# EAGLE board FE3_V3_R11_Release (EAGLE 7.6.0), part 1 of 2
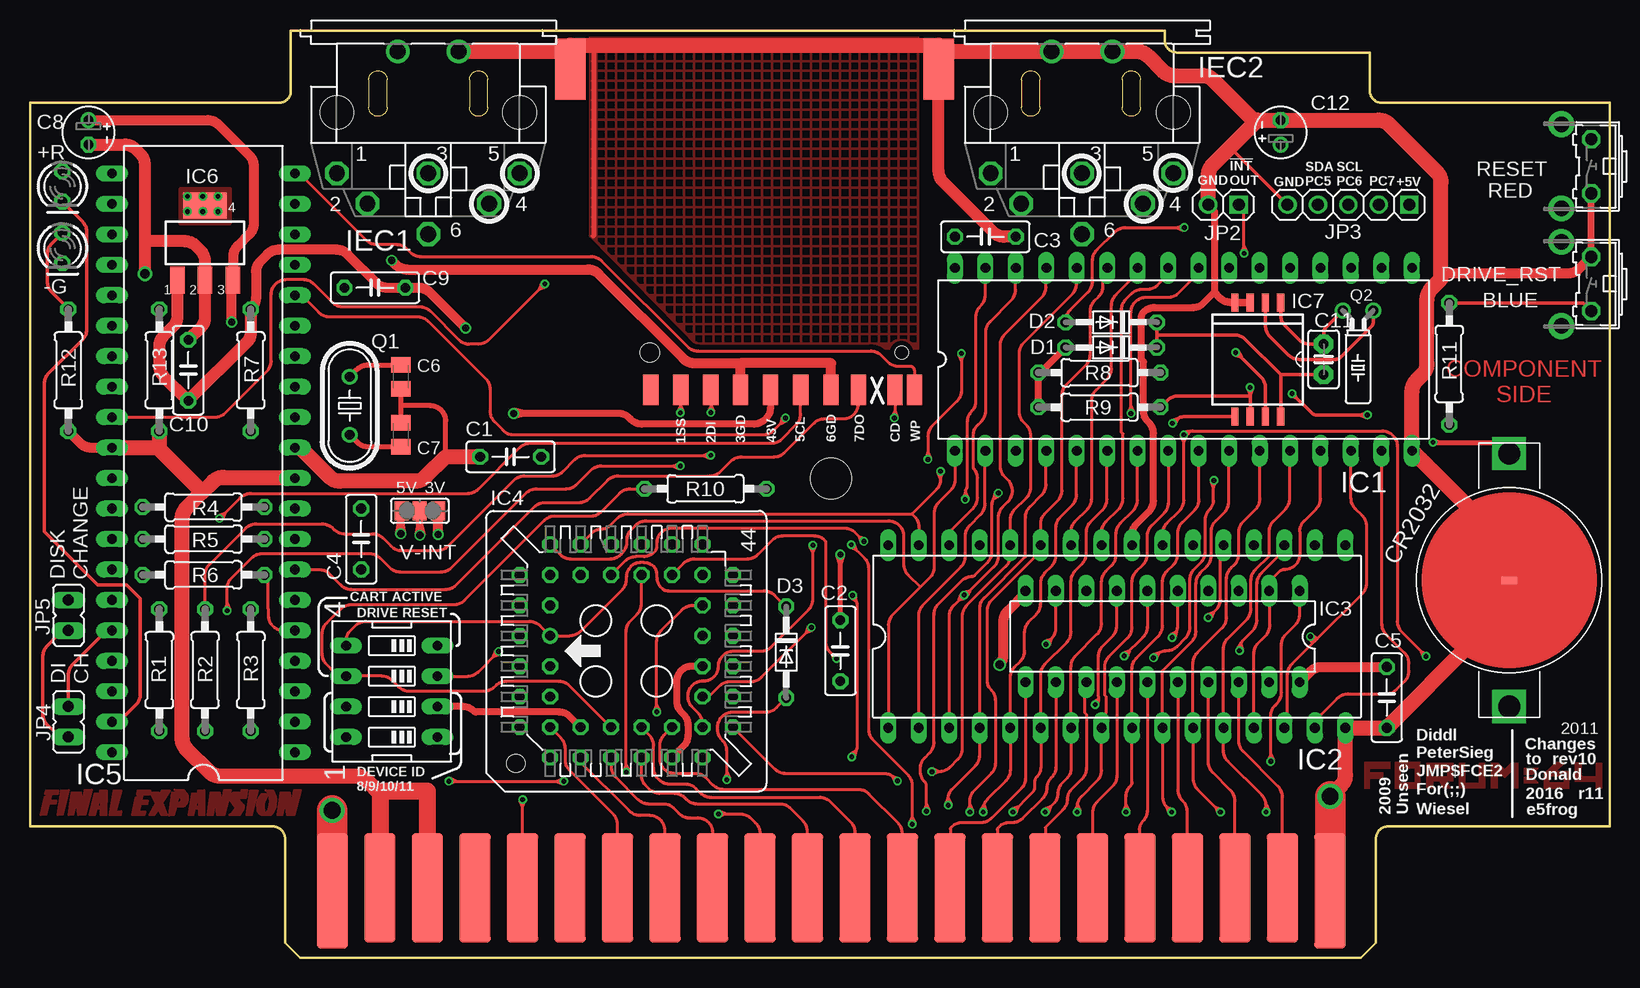
[diagram p1: board, top side]
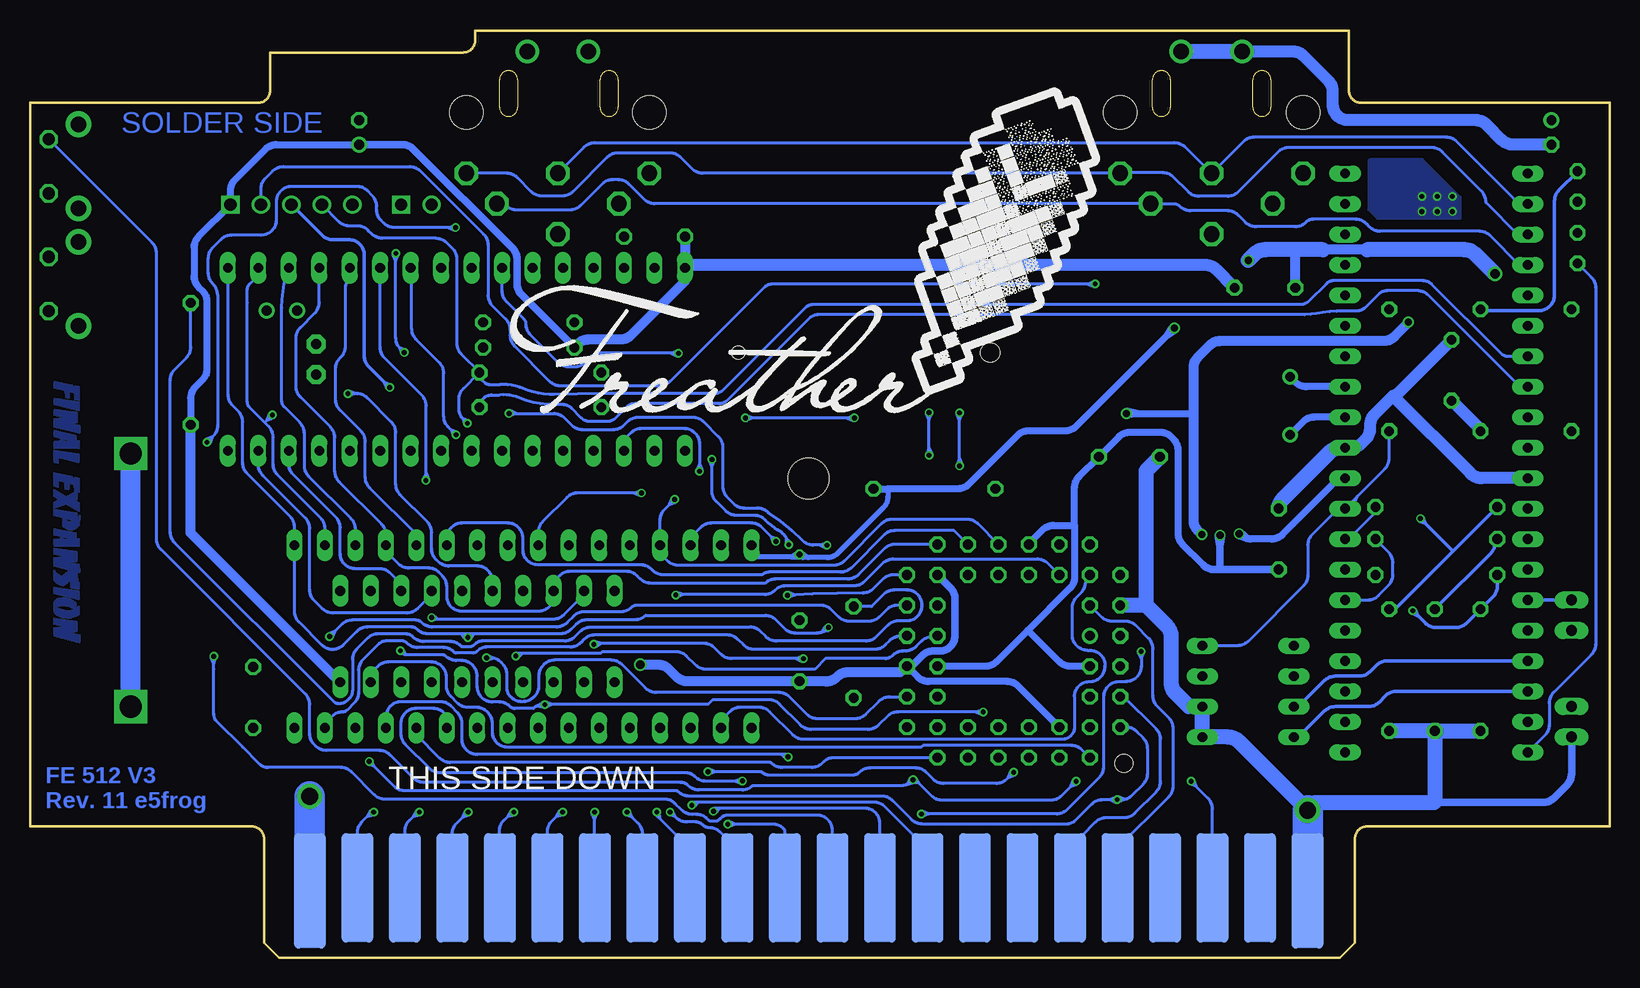
[diagram p2: board, bottom side, seen from below]

Size 131.7 x 77.3 mm. Coordinates in mm from the lower left corner, seen from the top.
Outline: 0,10.96 20.26,10.96 arc-90 21.26,9.96 21.26,1.27 22.53,0 110.92,0 112.19,1.27 112.19,9.96 arc-90 113.19,10.96 131.7,10.96 131.7,71.3 112.69,71.3 arc-90 111.69,72.3 111.69,75.49 95.59,75.49 arc-90 94.59,76.49 94.59,77.3 21.75,77.3 21.75,72.3 arc-90 20.75,71.3 0,71.3 0,10.96
Outline: 28.24,73.22 arc-180 29.77,73.22 29.77,70.93 arc-180 28.24,70.93 28.24,73.22
Outline: 36.62,73.22 arc-180 38.15,73.22 38.15,70.93 arc-180 36.62,70.93 36.62,73.22
Outline: 82.66,73.22 arc-180 84.19,73.22 84.19,70.93 arc-180 82.66,70.93 82.66,73.22
Outline: 91.04,73.22 arc-180 92.57,73.22 92.57,70.93 arc-180 91.04,70.93 91.04,73.22
Copper layers (1*16): Top 0.035mm / dielectric 1.5mm / Bottom 0.035mm
Design rules "ITEADstudio_DRC": minimum track width 6mil, minimum drill 12mil, track to track 6mil, track to pad 6mil, pad to pad 6mil, via to via 6mil, smd to smd 0mil, copper to edge 10mil, drill to drill 10mil, minimum pad ring 10mil, minimum via ring 6mil, stop-mask expansion 2mil, vias tented up to drill 100mil, thermal gap 10mil
Net classes: 1 DiffPair: width 0.254 mm, drill 0.4 mm, clearance 0.6 mm
Holes 3.4 mm at 66.79,39.97
Holes 1.5 mm at 40.5,16.22
Holes 1.6 mm at 51.65,50.47
Holes 1.1 mm at 72.65,50.47
tRestrict: area 117,15.2 to 118.1,15.8; area 126.7,14.7 to 127.8,15.1

## Footprints (pad centres in the part's own frame; a part is rotated, then mirrored left to right if it is on the bottom)
SMD1,27-2,54 = smd 1.27 x 2.54: 1 0,0
LED3MM = drill 0.813 octagon: A -1.27,0; K 1.27,0
C050-025X075 = drill 0.813 octagon: 1 -2.54,0; 2 2.54,0
C0805K = smd 1.3 x 1.6: 1 -1,0; 2 1,0
E2-4 = drill 0.813 pad 1.27: + -1.016,0 | drill 0.813 pad 1.27 octagon: - 1.016,0
C2.5-2 = drill 0.813 pad 1.6 octagon: 1 -1.27,0; 2 1.27,0
CR2032_RETAINER_PK5 = drill 1.85 square: P$1 -10.55,0; P$2 10.55,0 | smd 0.635 x 1.27: P$3 0,0
DO34-7 = drill 0.813 octagon: A 3.81,0; C -3.81,0
EDG-04 = drill 0.813 long: 1 -3.81,-3.81; 2 -1.27,-3.81; 3 1.27,-3.81; 4 3.81,-3.81; 5 3.81,3.81; 6 1.27,3.81; 7 -1.27,3.81; 8 -3.81,3.81
B3F-31XX = drill 1.016 octagon: 1 -2.261,-1.245; 2 2.261,-1.245 | drill 1.295 pad 2.159: 3 -3.505,1.245; 4 3.505,1.245
DIL32 = drill 0.813 long: 1 -17.78,-7.62; 2 -15.24,-7.62; 3 -12.7,-7.62; 4 -10.16,-7.62; 5 -7.62,-7.62; 6 -5.08,-7.62; 7 -2.54,-7.62; 8 0,-7.62; 9 2.54,-7.62; 10 5.08,-7.62; 11 7.62,-7.62; 12 10.16,-7.62; 13 12.7,-7.62; 14 15.24,-7.62; 15 17.78,-7.62; 16 20.32,-7.62; 17 20.32,7.62; 18 17.78,7.62; 19 15.24,7.62; 20 12.7,7.62; 21 10.16,7.62; 22 7.62,7.62; 23 5.08,7.62; 24 2.54,7.62; 25 0,7.62; 26 -2.54,7.62; 27 -5.08,7.62; 28 -7.62,7.62; 29 -10.16,7.62; 30 -12.7,7.62; 31 -15.24,7.62; 32 -17.78,7.62
DIL32' = drill 0.813 long: 1 -19.05,-7.62; 2 -16.51,-7.62; 3 -13.97,-7.62; 4 -11.43,-7.62; 5 -8.89,-7.62; 6 -6.35,-7.62; 7 -3.81,-7.62; 8 -1.27,-7.62; 9 1.27,-7.62; 10 3.81,-7.62; 11 6.35,-7.62; 12 8.89,-7.62; 13 11.43,-7.62; 14 13.97,-7.62; 15 16.51,-7.62; 16 19.05,-7.62; 17 19.05,7.62; 18 16.51,7.62; 19 13.97,7.62; 20 11.43,7.62; 21 8.89,7.62; 22 6.35,7.62; 23 3.81,7.62; 24 1.27,7.62; 25 -1.27,7.62; 26 -3.81,7.62; 27 -6.35,7.62; 28 -8.89,7.62; 29 -11.43,7.62; 30 -13.97,7.62; 31 -16.51,7.62; 32 -19.05,7.62
DIL20 = drill 0.813 long: 1 -11.43,-3.81; 2 -8.89,-3.81; 3 -6.35,-3.81; 4 -3.81,-3.81; 5 -1.27,-3.81; 6 1.27,-3.81; 7 3.81,-3.81; 8 6.35,-3.81; 9 8.89,-3.81; 10 11.43,-3.81; 11 11.43,3.81; 12 8.89,3.81; 13 6.35,3.81; 14 3.81,3.81; 15 1.27,3.81; 16 -1.27,3.81; 17 -3.81,3.81; 18 -6.35,3.81; 19 -8.89,3.81; 20 -11.43,3.81
S44 = drill 0.813: 1 1.27,6.35 | drill 0.813 octagon: 2 -1.27,8.89; 3 -1.27,6.35; 4 -3.81,8.89; 5 -3.81,6.35; 6 -6.35,8.89; 7 -8.89,6.35; 8 -6.35,6.35; 9 -8.89,3.81; 10 -6.35,3.81; 11 -8.89,1.27; 12 -6.35,1.27; 13 -8.89,-1.27; 14 -6.35,-1.27; 15 -8.89,-3.81; 16 -6.35,-3.81; 17 -8.89,-6.35; 18 -6.35,-8.89; 19 -6.35,-6.35; 20 -3.81,-8.89; 21 -3.81,-6.35; 22 -1.27,-8.89; 23 -1.27,-6.35; 24 1.27,-8.89; 25 1.27,-6.35; 26 3.81,-8.89; 27 3.81,-6.35; 28 6.35,-8.89; 29 8.89,-6.35; 30 6.35,-6.35; 31 8.89,-3.81; 32 6.35,-3.81; 33 8.89,-1.27; 34 6.35,-1.27; 35 8.89,1.27; 36 6.35,1.27; 37 8.89,3.81; 38 6.35,3.81; 39 8.89,6.35; 40 6.35,8.89; 41 6.35,6.35; 42 3.81,8.89; 43 3.81,6.35; 44 1.27,8.89
DIL40 = drill 0.813 long: 1 -24.13,-7.62; 2 -21.59,-7.62; 3 -19.05,-7.62; 4 -16.51,-7.62; 5 -13.97,-7.62; 6 -11.43,-7.62; 7 -8.89,-7.62; 8 -6.35,-7.62; 9 -3.81,-7.62; 10 -1.27,-7.62; 11 1.27,-7.62; 12 3.81,-7.62; 13 6.35,-7.62; 14 8.89,-7.62; 15 11.43,-7.62; 16 13.97,-7.62; 17 16.51,-7.62; 18 19.05,-7.62; 19 21.59,-7.62; 20 24.13,-7.62; 21 24.13,7.62; 22 21.59,7.62; 23 19.05,7.62; 24 16.51,7.62; 25 13.97,7.62; 26 11.43,7.62; 27 8.89,7.62; 28 6.35,7.62; 29 3.81,7.62; 30 1.27,7.62; 31 -1.27,7.62; 32 -3.81,7.62; 33 -6.35,7.62; 34 -8.89,7.62; 35 -11.43,7.62; 36 -13.97,7.62; 37 -16.51,7.62; 38 -19.05,7.62; 39 -21.59,7.62; 40 -24.13,7.62
SOT223 = smd 1.219 x 2.235: 1 -2.311,-3.099; 2 0,-3.099; 3 2.311,-3.099 | smd 3.6 x 2.2: 4 0,3.099
SOT176-1 = smd 0.6 x 1.5: 1 -1.905,-4.75; 2 -0.635,-4.75; 3 0.635,-4.75; 4 1.905,-4.75; 5 1.905,4.75; 6 0.635,4.75; 7 -0.635,4.75; 8 -1.905,4.75
MAB6H = drill 1.321 octagon: 1 7.62,5.08; 2 5.08,7.62; 3 0,5.08; 4 -5.08,7.62; 5 -7.62,5.08; 6 0,10.16 | drill 1.321: PE -2.54,-5.08; PE@ 2.54,-5.08 | hole 2.794: 7.62,0; -7.62,0
1X02 = drill 1.016 square: 1 -1.27,0 | drill 1.016: 2 1.27,0
1X05 = drill 1.016 square: 1 -5.08,0 | drill 1.016: 2 -2.54,0; 3 0,0; 4 2.54,0; 5 5.08,0
JP1 = drill 0.914 long: 1 0,-1.27; 2 0,1.27
SMD2,54-5,08 = smd 2.54 x 5.08: 1 0,0
HC49U-V = drill 0.813: 1 -2.413,0; 2 2.413,0
TC26H = drill 0.813: 1 -1.27,0; 2 1.27,0
0207/10 = drill 0.813 octagon: 1 -5.08,0; 2 5.08,0
VIC-20_EXPANSION = smd 2.6 x 9.6: P$1 -41.58,1.98; P$22 41.58,1.98 | smd 2.6 x 9.1: P$2 -37.62,2.23; P$3 -33.66,2.23; P$4 -29.7,2.23; P$5 -25.74,2.23; P$6 -21.78,2.23; P$7 -17.82,2.23; P$8 -13.86,2.23; P$9 -9.9,2.23; P$10 -5.94,2.23; P$11 -1.98,2.23; P$12 1.98,2.23; P$13 5.94,2.23; P$14 9.9,2.23; P$15 13.86,2.23; P$16 17.82,2.23; P$17 21.78,2.23; P$18 25.74,2.23; P$19 29.7,2.23; P$20 33.66,2.23; P$21 37.62,2.23 | smd 2.6 x 9.6 bottom: P$23 -41.58,1.98; P$44 41.58,1.98 | smd 2.6 x 9.1 bottom: P$24 -37.62,2.23; P$25 -33.66,2.23; P$26 -29.7,2.23; P$27 -25.74,2.23; P$28 -21.78,2.23; P$29 -17.82,2.23; P$30 -13.86,2.23; P$31 -9.9,2.23; P$32 -5.94,2.23; P$33 -1.98,2.23; P$34 1.98,2.23; P$35 5.94,2.23; P$36 9.9,2.23; P$37 13.86,2.23; P$38 17.82,2.23; P$39 21.78,2.23; P$40 25.74,2.23; P$41 29.7,2.23; P$42 33.66,2.23; P$43 37.62,2.23
SJ_2 = smd 1.168 x 1.6: 1 -1.524,0; 2 0,0; 3 1.524,0

## Placement (x,y rotation side)
1SS  [SMD1,27-2,54]  54.24,47.38 0 top
2DI  [SMD1,27-2,54]  56.75,47.38 0 top
3GD  [SMD1,27-2,54]  59.22,47.38 0 top
5CL  [SMD1,27-2,54]  64.25,47.38 0 top
6GD  [SMD1,27-2,54]  66.77,47.38 0 top
7DO  [SMD1,27-2,54]  69.06,47.38 0 top
43V  [SMD1,27-2,54]  61.73,47.38 0 top
+R  [LED3MM]  2.7,64.33 270 top
-G  [LED3MM]  2.7,59.18 270 top
C1  100nF  [C050-025X075]  40.05,41.78 180 top
C2  100nF  [C050-025X075]  67.55,25.61 270 top
C3  100nF  [C050-025X075]  79.64,60.13 0 top
C4  100nF  [C050-025X075]  27.61,34.92 90 top
C5  100nF  [C050-025X075]  113.1,21.72 270 top
C6  33pF  [C0805K]  30.91,48.45 270 top
C7  33pF  [C0805K]  30.91,43.62 90 top
C8  22µF  [E2-4]  4.88,68.83 270 top
C9  100nF  [C050-025X075]  28.75,55.88 180 top
C10  100nF  [C050-025X075]  13.2,49 90 top
C11  22pF  [C2.5-2]  107.84,49.91 90 top
C12  100µF  [E2-4]  104.25,68.83 90 top
CD  [SMD1,27-2,54]  72.11,47.38 0 top
CR2032  CR2032_RETAINER_PK5  [CR2032_RETAINER_PK5]  123.3,31.5 270 top
D1  BAT85  [DO34-7]  90.13,50.9 180 top
D2  BAT85  [DO34-7]  90.13,53 180 top
D3  BAT85  [DO34-7]  63.04,25.5 270 top
DEVICE  [EDG-04]  30.16,22.22 90 top
DRIVE_RST  [B3F-31XX]  128.9,56.2 90 top
IC1  AM29F040B  [DIL32]  94.88,49.91 0 top
IC2  4Mb-55  [DIL32']  90.6,26.8 0 top
IC3  74LS245N  [DIL20]  94.41,26.8 180 top
IC4  CPLD-ATF1504-AS  [S44]  49.71,25.59 90 top
IC5  ATMEGA1284P  [DIL40]  14.46,41.27 90 top
IC6  3V3REG_1703  [SOT223]  14.59,59.63 0 top
IC7  PCF8583T  [SOT176-1]  102.35,49.91 180 top
IEC1  MAB6H  [MAB6H]  33.2,70.5 180 top
IEC2  MAB6H  [MAB6H]  87.7,70.5 180 top
JP2  [1X02]  99.49,62.8 180 top
JP3  [1X05]  109.9,62.8 180 top
JP4  [JP1]  3.2,19.68 0 top
JP5  [JP1]  3.2,28.57 0 top
NC_9  [SMD1,27-2,54]  51.75,47.38 0 top
PAD1  [SMD2,54-5,08]  45.04,74.1 0 top
PAD2  [SMD2,54-5,08]  75.75,74.1 180 top
Q1  8.000MHz  [HC49U-V]  26.66,46.04 270 top
Q2  32768Hz  [TC26H]  110.7,53.98 180 top
R1  3k3  [0207/10]  10.78,24 90 top
R2  3k3  [0207/10]  14.59,24 90 top
R3  3k3  [0207/10]  18.4,24 90 top
R4  1k8  [0207/10]  14.46,37.59 0 top
R5  1k8  [0207/10]  14.46,34.92 0 top
R6  1k8  [0207/10]  14.46,31.94 0 top
R7  10k  [0207/10]  18.4,49 90 top
R8  1k8  [0207/10]  89.15,48.8 180 top
R9  1k8  [0207/10]  89.15,45.92 180 top
R10  10k  [0207/10]  56.31,39.12 180 top
R11  10k  [0207/10]  118.31,49.53 270 top
R12  470  [0207/10]  3.2,49 90 top
R13  470  [0207/10]  10.78,49 90 top
RESET  [B3F-31XX]  128.9,66 90 top
U$2  VIC-20_EXPANSION  [VIC-20_EXPANSION]  66.79,3.62 0 top
V-INT  [SJ_2]  32.5,37.27 180 top
WP  [SMD1,27-2,54]  73.73,47.36 0 top

## Tracks (layer width: path | path; a pad name or v marks a point on that pad's centre or on a via)
3V3  (via drill 0.6)
  Top 0.6: 43V.1 61.73,45.88 arc-45 61.35,44.99 61.25,44.88 arc-45 60.36,44.51 50.99,44.51 arc-45 50.1,44.88 49.95,45.03 arc45 49.05,45.4 v40.31,45.4 | v40.31,45.4 40.34,45.58 41.21,45.4 40.34,45.23 v40.31,45.4
  Top 0.813: v34.02,35.31 V-INT.1 | C8.+ 14.83,69.85 arc-45 15.72,69.48 18.28,66.92 arc-45 18.65,66.02 18.65,61.23 arc-45 18.28,60.33 17.31,59.36 arc45 16.94,58.47 16.94,56.57 IC6.3 16.81,56.44 v16.81,53.02
  Bottom 0.6: v40.31,45.4 34.78,45.4 34.72,45.47 | v40.31,45.4 40.27,45.23 39.41,45.4 40.27,45.58 v40.31,45.4
  Bottom 0.813: v16.81,53.02 16.81,52.96 17.96,51.81 arc45 18.86,51.44 32.48,51.44 arc-45 33.38,51.06 34.35,50.09 arc-45 34.72,49.19 34.72,45.47 34.72,36.53 arc-45 34.35,35.63 v34.02,35.31
!C_RESET  (via drill 0.4)
  Top 0.254: v34.91,14.73 v44.5,14.73 | v58.09,14.86 58.09,17.25 arc45 57.72,18.15 57.7,18.17 arc-45 57.33,19.07 57.33,19.24 arc-90 58.6,20.51 61.34,20.51 arc45 62.24,20.88 D3.A | v58.09,14.86 57.87,14.96 58.09,15.46 58.31,14.96 v58.09,14.86 | v34.91,14.73 35.01,14.95 35.51,14.73 35.01,14.51 v34.91,14.73 | v44.5,14.73 44.4,14.51 43.9,14.73 44.4,14.95 v44.5,14.73
  Bottom 0.254: 33.2,5.65 33.13,5.59 U$2.P$25 33.13,12.42 arc-45 33.5,13.32 v34.91,14.73 | v44.5,14.73 45.72,13.52 arc45 46.61,13.14 55.66,13.14 arc45 56.55,13.52 57.9,14.86 v58.09,14.86 | v58.09,14.86 58.22,14.72 arc45 59.12,14.35 71.49,14.35 arc45 72.33,14 75.95,14 arc45 76.84,14.37 arc-45 77.48,14.64 98.87,14.64 arc45 99.77,15.01 101.69,16.93 arc-45 102.59,17.3 107,17.3 arc45 107.89,17.68 108.01,17.79 arc45 108.38,18.69 108.38,21.13 arc-45 108.75,22.02 120.77,34.05 arc45 121.14,34.94 121.14,58.73 arc-45 121.52,59.63 RESET.2 | v58.09,14.86 58.12,14.62 57.58,14.54 57.89,14.99 v58.09,14.86 | v58.09,14.86 58.3,14.97 58.56,14.48 58.03,14.62 v58.09,14.86 | v34.91,14.73 35,14.51 34.49,14.31 34.68,14.82 v34.91,14.73 | v44.5,14.73 44.73,14.82 44.92,14.31 44.41,14.51 v44.5,14.73
!RESET
  Top 0.254: DEVICE.5 26.35,26.41 arc-45 26.72,27.3 27.11,27.7 arc-45 28.01,28.07 41.62,28.07 arc-45 42.52,27.7 42.98,27.23 arc45 43.88,26.86 | D3.C 63.01,29.3 62.08,30.23 arc45 61.18,30.61 53.25,30.61 arc-45 52.62,30.87 arc-45 52.25,31.77 52.25,32.1 arc45 52.05,32.59 arc45 51.15,32.96 50.87,32.96 arc45 50.08,32.63 arc45 49.71,31.73 49.71,31.58 arc-45 49.33,30.68 45.89,27.23 arc-45 44.99,26.86 43.88,26.86 | IC4.1 43.88,26.86
  Top 0.305: R11.1 129.47,54.61 DRIVE_RST.1
  Bottom 0.254: D3.C 61.55,29.3 60.55,30.3 arc45 59.66,30.67 58.6,30.67 arc90 57.33,29.4 arc90 58.6,28.13 59.28,28.13 arc-45 60.17,27.76 61.15,26.79 arc45 62.04,26.42 69.47,26.42 arc45 70.37,26.79 70.8,27.22 arc-45 71.7,27.59 84.96,27.59 arc-45 85.86,27.22 86.26,26.82 arc45 87.16,26.45 93.82,26.45 arc-45 94.72,26.08 arc45 95.05,25.94 95.61,25.94 arc45 95.78,26.01 arc-45 96.68,26.38 98.87,26.38 arc45 99.77,26.76 arc-45 100.4,27.02 102.68,27.02 arc-45 103.58,26.65 104.45,25.77 arc-45 104.82,24.87 104.82,22.29 arc45 105.12,21.58 arc45 106.02,21.21 arc45 106.37,21.35 119.63,34.62 arc45 120,35.52 120,48.18 arc45 119.63,49.08 118.66,50.05 arc-45 118.29,50.95 118.29,54.59 R11.1
!WE  (via drill 0.4)
  Top 0.254: IC1.31 79.64,55.29 arc-45 79.27,54.39 79.19,54.31 arc45 78.82,53.42 78.82,46.37 arc-45 78.49,45.58 arc45 78.12,44.69 78.12,39.37 arc-45 77.96,38.99 v77.96,38.23 | v77.96,38.23 77.74,38.33 77.96,38.83 78.19,38.33 v77.96,38.23
  Bottom 0.254: v77.96,38.23 78.8,37.39 arc-45 79.17,36.49 IC2.29 79.17,33.72 78.56,33.11 arc-45 77.66,32.73 64.71,32.73 arc-45 63.81,33.11 60.71,36.2 arc45 59.82,36.58 53.6,36.58 arc45 52.7,36.2 IC4.33 | v77.96,38.23 78.19,38.31 78.39,37.8 77.88,38 v77.96,38.23
+5V  (via drill 0.5, 0.6)
  Top 0.254: V-INT.3 32.18,37.27
  Top 0.406: C2.1 v67.55,33.64 | v67.55,33.64 67.76,33.58 67.55,32.89 67.34,33.58 v67.55,33.64
  Top 0.6: R9.2 R8.2 84.22,48.8 D1.A | 30.97,37.4 V-INT.3
  Top 0.61: v30.91,35.37 30.91,37.4 V-INT.3 | v30.91,35.37 30.74,35.4 30.91,36.27 31.08,35.4 v30.91,35.37
  Top 0.813: U$2.P$3 33.2,5.6 | IC3.20 106.74,23.89 arc-45 107.64,24.26 C5.1 | R7.2 18.47,54.15 arc45 18.84,55.05 18.84,57.2 arc-45 19.22,58.09 19.81,58.68 arc-45 20.7,59.05 25.56,59.05 arc-45 26.46,58.68 28.89,56.25 arc45 29.79,55.88 C9.1 32.42,55.88 arc-45 33.31,55.51 v36.31,52.51 | R12.1 4.2,42.92 arc45 5.1,42.55 IC5.30
  Top 1: 22.02,40.07 IC5.10
  Top 1.016: IC6.1 12.28,53.4 arc-45 11.99,52.7 11.08,51.79 arc45 10.79,51.09 10.79,49.28 arc45 11.08,48.58 C10.1 18.11,51.37 arc45 18.4,52.08 R7.2
  Top 1.27: 29.2,13.65 28.04,14.8 arc45 27.14,15.18 15.81,15.18 arc-45 14.92,15.55 13.06,17.41 arc-45 12.69,18.31 12.69,36.62 arc-45 13.06,37.52 14.37,38.83 | 14.37,38.83 15.23,39.7 arc-45 16.13,40.07 22.02,40.07 | IC5.30 10.65,42.55 10.78,42.42 | 10.78,42.42 14.37,38.83 | R13.1 10.78,42.42
  Top 1.422: U$2.P$3 33.13,13.9 29.2,13.9 29.2,13.65 29.2,5.63 U$2.P$2
  Bottom 0.406: 60.18,39.12 60.18,38.44 arc45 60.55,37.54 64.34,33.75 arc45 65.24,33.38 67.29,33.38 v67.55,33.64 | IC2.32 71.52,34.39 71.52,33.83 71.14,33.45 67.74,33.45 v67.55,33.64 | v67.55,33.64 67.56,33.42 66.84,33.38 67.42,33.81 v67.55,33.64 | v67.55,33.64 67.66,33.82 68.28,33.45 67.56,33.42 v67.55,33.64
  Bottom 0.6: IC5.10 22.59,40.01 27.3,35.3 arc45 28.2,34.92 29.94,34.92 arc45 30.84,35.3 v30.91,35.37 | R11.2 118.31,46.7 arc45 117.93,47.6 117.32,48.21 arc-45 116.95,49.1 116.95,54.72 arc-45 117.32,55.62 117.66,55.95 arc45 118.03,56.85 118.03,59.23 arc45 117.66,60.12 JP3.1 114.98,63.99 arc45 114.61,64.89 112.05,67.45 arc45 111.16,67.82 C12.+ | R10.1 60.18,39.12 54.36,39.12 arc-45 53.46,39.49 49.38,43.57 arc45 48.48,43.94 45.41,43.94 arc-45 44.51,44.31 v36.31,52.51 | v36.31,52.51 36.46,52.61 36.94,51.88 36.21,52.36 v36.31,52.51 | v30.91,35.37 30.96,35.2 30.12,34.94 30.79,35.51 v30.91,35.37
  Bottom 0.61: 86.31,50.9 D1.A 90.74,55.32 arc45 91.11,56.22 91.11,58.27 arc-45 91.48,59.17 99.75,67.45 arc-45 100.65,67.82 C12.+ | IC1.32 77.1,57.88
  Bottom 0.813: IC3.20 118.31,35.45 R11.2 | C3.1 IC1.32 | IC1.32 | IC1.32 77.1,56.43 81.59,51.93 arc45 82.49,51.56 85.13,51.56 arc-45 86.03,51.19 D1.A
  Bottom 1.016: C9.1 32.82,57.41 arc-45 33.72,57.78 77.1,57.78 IC1.32 | R13.1 arc-45 10.87,44.13 C10.1
A0  (via drill 0.4)
  Top 0.254: IC1.12 105.01,42.27 105.01,38.31 arc-45 104.64,37.41 103.67,36.44 arc45 103.3,35.54 103.3,33.53 102.15,32.38 arc45 101.78,31.48 101.78,29.1 arc-45 101.4,28.2 99.86,26.66 arc45 99.49,25.76 IC2.12 99.49,17.29 arc45 99.86,16.39 102.67,13.58 arc-45 103.05,12.68 v103.05,12.16 | v103.05,12.16 102.82,12.26 103.04,12.76 103.27,12.26 v103.05,12.16
  Bottom 0.254: U$2.P$43 104.41,10.43 arc45 104.04,11.33 103.2,12.16 v103.05,12.16 | IC2.12 99.49,18.61 97.54,16.66 arc-45 96.65,16.29 69.99,16.29 arc45 69.89,16.25 arc-45 68.99,15.87 66.55,15.87 arc-45 65.65,16.25 65.57,16.33 arc45 64.67,16.7 IC4.17 | v103.05,12.16 103.25,12.29 103.54,11.82 103,11.92 v103.05,12.16
A1  (via drill 0.4)
  Top 0.254: IC1.11 102.54,42.27 102.54,38.31 arc-45 102.17,37.41 101.13,36.38 arc45 100.76,35.48 100.76,33.67 arc-45 100.39,32.77 100.12,32.5 arc45 99.74,31.61 99.74,28.4 arc-45 99.37,27.5 97.32,25.45 arc45 96.95,24.56 IC2.11 96.95,14.97 arc45 97.32,14.07 v99.24,12.16 | v72.31,14.76 72.08,14.99 arc45 71.18,15.37 63,15.37 arc-45 62.1,15.74 IC4.18 | v99.24,12.16 99.01,12.07 98.81,12.59 99.32,12.39 v99.24,12.16 | v72.31,14.76 72.09,14.66 71.87,15.17 72.39,14.99 v72.31,14.76
  Bottom 0.254: U$2.P$42 100.44,5.6 100.44,10.59 arc45 100.07,11.48 99.39,12.16 v99.24,12.16 | v72.31,14.76 75.37,14.76 arc45 76.27,15.14 arc-45 77.06,15.46 97.53,15.46 arc45 98.43,15.83 100.42,17.82 arc45 100.79,18.72 100.79,19.53 arc90 99.52,20.8 98.08,20.8 arc45 97.18,20.42 96.95,20.19 IC2.11 | v99.24,12.16 99.44,12.29 99.73,11.82 99.19,11.92 v99.24,12.16 | v72.31,14.76 72.41,14.99 72.91,14.76 72.41,14.54 v72.31,14.76
A2  (via drill 0.4)
  Top 0.254: IC1.10 99.93,42.27 99.93,38.05 arc-45 99.56,37.16 98.85,36.44 arc45 98.47,35.54 98.47,33.55 arc-45 98.1,32.65 97.58,32.12 arc45 97.2,31.22 97.2,27.26 arc-45 96.83,26.36 94.41,23.94 IC2.10 94.41,13.45 arc45 94.78,12.55 v95.17,12.16 | v95.17,12.16 94.95,12.07 94.75,12.59 95.26,12.39 v95.17,12.16
  Bottom 0.254: U$2.P$41 96.51,5.62 96.51,10.33 arc45 96.13,11.23 95.2,12.16 v95.17,12.16 | v95.17,12.16 95.39,12.26 95.61,11.75 95.09,11.93 v95.17,12.16
A3  (via drill 0.4)
  Top 0.254: IC1.9 97.46,42.27 97.46,38.24 arc-45 97.09,37.35 96.05,36.31 arc45 95.68,35.41 95.68,33.67 arc-45 95.31,32.77 94.78,32.25 arc45 94.41,31.35 94.41,27.7 arc-45 94.04,26.81 92.24,25.01 arc45 91.87,24.11 IC2.9 91.87,14.67 arc-45 91.73,14.34 arc45 91.36,13.44 v91.36,12.16 | v91.36,12.16 91.14,12.26 91.36,12.76 91.58,12.26 v91.36,12.16
  Bottom 0.254: U$2.P$40 92.57,5.64 92.57,10.59 arc45 92.2,11.48 91.52,12.16 v91.36,12.16 | v91.36,12.16 91.57,12.29 91.86,11.82 91.32,11.92 v91.36,12.16
A4  (via drill 0.4)
  Top 0.254: IC1.8 94.92,42.27 94.92,37.99 arc-45 94.55,37.09 93.51,36.06 arc45 93.14,35.16 93.14,33.67 arc-45 92.77,32.77 92.24,32.25 arc45 91.87,31.35 91.87,27.58 arc-45 91.5,26.68 89.96,25.14 arc45 89.58,24.24 89.58,21.91 89.71,21.78 89.71,20.45 89.33,20.07 IC2.8 89.33,15.67 arc-45 88.96,14.77 87.67,13.48 arc45 87.3,12.59 v87.3,12.16 | v87.3,12.16 87.08,12.26 87.31,12.76 87.52,12.25 v87.3,12.16
  Bottom 0.254: U$2.P$39 88.57,5.6 88.57,10.52 arc45 88.2,11.42 87.46,12.16 v87.3,12.16 | v87.3,12.16 87.5,12.29 87.79,11.82 87.25,11.92 v87.3,12.16
A5  (via drill 0.4)
  Top 0.254: IC1.7 92.31,42.27 92.31,38.18 arc-45 91.94,37.28 90.91,36.25 arc45 90.54,35.35 90.54,33.61 arc-45 90.17,32.71 89.7,32.25 arc45 89.33,31.35 89.33,27.89 arc-45 88.96,27 87.16,25.2 arc45 86.79,24.3 IC2.7 86.79,15.86 arc-45 86.42,14.96 86.03,14.57 arc45 85.68,13.73 arc-45 85.31,12.84 v84.63,12.16 | v84.63,12.16 84.54,12.39 85.06,12.59 84.86,12.07 v84.63,12.16
  Bottom 0.254: U$2.P$38 84.63,5.62 v84.63,12.16 | v84.63,12.16 84.85,12.06 84.63,11.56 84.41,12.06 v84.63,12.16
A6  (via drill 0.4)
  Top 0.254: IC1.6 89.78,42.27 89.78,38.24 arc-45 89.4,37.35 88.43,36.38 arc45 88.06,35.48 88.06,33.74 arc-45 87.69,32.84 87.16,32.31 arc45 86.79,31.41 86.79,27.2 arc-45 86.42,26.3 84.62,24.5 arc45 84.25,23.6 IC2.6 84.25,15.88 arc-45 83.93,15.11 arc45 83.74,14.65 83.74,14.54 83.74,14.23 arc-45 83.56,13.79 v81.93,12.16 | v81.93,12.16 81.84,12.39 82.36,12.59 82.16,12.07 v81.93,12.16
  Bottom 0.254: U$2.P$37 80.63,5.62 80.63,10.33 arc-45 81,11.23 v81.93,12.16 | v81.93,12.16 82.02,11.93 81.51,11.74 81.71,12.25 v81.93,12.16
A7  (via drill 0.4)
  Top 0.254: 87.23,42.27 IC1.5 87.23,42.26 87.23,38.63 arc-45 86.86,37.73 85.89,36.76 arc45 85.52,35.86 85.52,33.55 arc-45 85.15,32.65 84.62,32.12 arc45 84.25,31.22 84.25,29.55 arc-45 83.88,28.65 83.29,28.06 arc45 82.92,27.16 82.92,25.61 arc-45 82.55,24.71 82.08,24.25 arc45 81.71,23.35 IC2.5 81.71,15.67 arc-45 81.34,14.77 79.83,13.26 arc45 79.46,12.36 v79.46,12.16 | v79.46,12.16 79.25,12.28 79.52,12.76 79.69,12.23 v79.46,12.16
  Bottom 0.254: 76.69,5.61 U$2.P$36 76.92,5.83 76.92,9.37 79.2,11.65 arc37 v79.46,12.16 | v79.46,12.16 79.61,11.97 79.18,11.63 79.21,12.18 v79.46,12.16
A8  (via drill 0.4)
  Top 0.254: v78.34,12.16 78.34,13.06 arc-45 78.72,13.96 80.13,15.38 arc45 80.5,16.27 80.5,21.45 arc45 80.13,22.34 arc-45 79.81,23.13 79.81,28.94 arc-45 80.18,29.84 84.12,33.78 84.12,34.29 IC2.27 84.25,36.18 arc-45 84.62,37.08 85.66,38.11 arc45 86.03,39.01 86.03,46.91 arc-45 86.4,47.81 88.01,49.41 arc45 88.38,50.31 88.38,53.89 arc-45 88.75,54.79 89.09,55.13 arc45 89.46,56.02 89.46,56.77 89.8,57.12 IC1.27 | v78.34,12.16 78.12,12.26 78.34,12.76 78.57,12.26 v78.34,12.16
  Bottom 0.254: U$2.P$35 72.73,9.05 74.16,10.48 arc-45 75.06,10.85 arc45 75.62,11.09 arc-45 76.22,11.34 76.96,11.34 arc45 77.86,11.71 78.31,12.16 v78.34,12.16 | v78.34,12.16 78.42,11.93 77.91,11.75 78.12,12.26 v78.34,12.16
A9  (via drill 0.4)
  Top 0.254: IC2.26 86.79,35.54 arc-45 87.16,36.44 88.13,37.41 arc45 88.51,38.31 88.51,46.46 arc-45 88.88,47.36 89.78,48.27 arc45 90.16,49.17 90.16,54.4 arc-45 90.53,55.3 92.31,57.09 92.31,57.52 IC1.26 | v77.65,50.42 77.65,47.33 arc-45 77.27,46.43 75.22,44.38 arc45 74.85,43.48 v74.85,41.56 | v68.45,34.45 69.53,33.38 arc-45 69.9,32.48 69.9,19.07 arc45 70.27,18.17 73.17,15.27 arc-45 73.54,14.37 v73.54,11.15 | v73.54,11.15 73.32,11.25 73.54,11.75 73.76,11.25 v73.54,11.15 | v68.45,34.45 68.68,34.54 68.88,34.03 68.37,34.23 v68.45,34.45 | v77.65,50.42 77.87,50.32 77.65,49.82 77.42,50.32 v77.65,50.42 | v74.85,41.56 74.63,41.66 74.85,42.16 75.07,41.66 v74.85,41.56
  Bottom 0.254: U$2.P$34 68.77,10.54 arc-45 68.87,10.78 arc-45 69.77,11.15 v73.54,11.15 | v77.65,50.42 84.11,50.42 arc-45 85,50.05 85.4,49.65 arc45 86.3,49.28 86.77,49.28 arc45 87.67,49.65 89.97,51.95 arc45 90.35,52.85 arc-45 90.51,53.25 91.97,54.71 arc45 92.34,55.61 IC1.26 | v68.45,34.45 68.45,34.48 | v74.85,41.56 74.85,38.94 arc-45 74.48,38.05 73.7,37.27 arc-45 72.8,36.89 71.31,36.89 arc45 70.42,36.52 arc-15 69.33,35.69 arc50 v68.45,34.45 | v73.54,11.15 73.44,10.93 72.94,11.15 73.44,11.37 v73.54,11.15 | v68.45,34.45 68.28,34.62 68.66,35.02 68.7,34.47 v68.45,34.45 | v77.65,50.42 77.74,50.64 78.25,50.42 77.74,50.2 v77.65,50.42 | v74.85,41.56 75.07,41.46 74.85,40.96 74.63,41.46 v74.85,41.56
A10  (via drill 0.4)
  Top 0.254: IC2.23 94.41,35.35 arc-45 94.78,36.25 95.82,37.28 arc45 96.19,38.18 v96.19,43.62 | v96.19,43.62 arc-45 96.95,43.94 112.7,43.94 arc-90 113.97,42.67 113.97,28.09 arc45 114.34,27.19 v116.38,25.15 | v96.19,43.62 96.17,43.61 | v116.38,25.15 116.15,25.06 115.96,25.57 116.47,25.37 v116.38,25.15 | v96.19,43.62 96.41,43.53 96.19,43.02 95.97,43.53 v96.19,43.62 | v96.19,43.62 96.17,43.87 96.71,43.91 96.38,43.48 v96.19,43.62
  Bottom 0.254: U$2.P$33 64.81,10.64 arc-90 66.08,11.91 73.6,11.91 arc-45 74.24,11.53 arc45 74.54,11.4 74.98,11.4 arc45 75.24,11.6 arc-45 76.14,11.97 76.48,11.97 arc45 77.38,12.34 77.91,12.87 arc-45 78.81,13.24 102.11,13.24 arc45 103.01,13.61 104.9,15.5 arc-45 105.8,15.88 111.87,15.88 arc45 112.58,16.17 113.99,17.58 116.09,19.68 arc45 116.38,20.39 116.38,24.09 v116.38,25.15 | v96.19,43.62 96.83,44.27 arc45 97.2,45.17 97.2,48.75 arc-45 97.58,49.65 99.5,51.57 arc45 99.87,52.47 99.87,57.44 IC1.23 | v116.38,25.15 116.6,25.05 116.38,24.55 116.16,25.05 v116.38,25.15 | v96.19,43.62 96.1,43.85 96.61,44.05 96.42,43.54 v96.19,43.62
A11  (via drill 0.4)
  Top 0.254: IC2.25 89.33,35.48 arc-45 89.7,36.38 90.74,37.41 arc45 91.11,38.31 91.11,43.69 90.98,43.81 90.98,54.02 arc-45 91.35,54.92 91.82,55.38 arc-45 92.71,55.75 93.12,55.75 arc45 94.02,56.12 94.76,56.86 IC1.25 | v80.73,38.77 80.56,38.6 arc45 80.19,37.7 80.19,33.86 arc-45 79.81,32.97 78.74,31.89 arc-45 78.55,31.81 arc45 77.66,31.44 75.73,29.52 arc45 75.36,28.62 75.36,17.99 arc-45 74.99,17.09 74.59,16.69 arc45 74.22,15.79 74.22,15.58 arc45 74.59,14.68 arc-45 74.73,14.35 v74.73,12.22 | v74.73,12.22 74.5,12.32 74.73,12.82 74.95,12.32 v74.73,12.22 | v80.73,38.77 80.83,38.55 80.34,38.31 80.49,38.83 v80.73,38.77
  Bottom 0.254: U$2.P$32 60.85,11.21 arc-90 62.12,12.48 74.47,12.48 v74.73,12.22 | v80.73,38.77 86.04,38.77 arc-45 86.94,38.4 88.96,36.38 arc-45 89.33,35.48 IC2.25 | v74.73,12.22 74.54,12.06 74.18,12.48 74.73,12.47 v74.73,12.22 | v80.73,38.77 80.82,38.99 81.33,38.77 80.82,38.55 v80.73,38.77
A12  (via drill 0.4)
  Top 0.254: IC1.4 84.7,42.27 84.7,39.48 arc-45 84.32,38.59 83.35,37.62 arc45 82.98,36.72 82.98,33.47 79.54,30.03 arc45 79.17,29.13 IC2.4 79.17,16.91 arc-45 78.8,16.01 76.91,14.12 arc45 76.53,13.22 v76.53,12.73 | v76.53,12.73 76.31,12.83 76.54,13.33 76.76,12.83 v76.53,12.73
  Bottom 0.254: U$2.P$31 56.89,9.05 60.45,12.61 arc-45 61.35,12.99 76.28,12.99 v76.53,12.73 | v76.53,12.73 76.35,12.57 75.99,12.99 76.54,12.97 v76.53,12.73
A13  (via drill 0.4)
  Top 0.254: IC1.28 87.23,57.52 87.23,56.22 arc-45 86.86,55.32 82.84,51.3 arc45 82.47,50.4 82.47,45.55 arc45 82.84,44.65 83.05,44.44 arc-45 83.42,43.54 83.42,39.26 arc-45 83.05,38.36 82.08,37.39 arc45 81.71,36.49 IC2.28 81.7,34 81.7,33.53 arc-45 81.33,32.63 78.07,29.37 arc45 77.7,28.47 77.7,17.45 arc-45 77.33,16.55 76.68,15.9 arc-45 75.78,15.53 v75.18,15.53 | v49.7,15.48 49.7,27.22 arc-45 50.07,28.11 50.6,28.65 arc45 50.98,29.55 IC4.34 | v49.7,15.48 49.48,15.58 49.7,16.08 49.92,15.58 v49.7,15.48 | v75.18,15.53 75.28,15.75 75.78,15.53 75.28,15.3 v75.18,15.53
  Bottom 0.254: v49.7,15.48 50.27,14.91 arc45 51.17,14.54 55.53,14.54 arc45 56.43,14.91 56.99,15.47 arc-45 57.88,15.84 61.66,15.84 arc-45 62.56,15.47 arc45 63.11,15.24 70.07,15.24 arc45 70.76,15.53 v75.18,15.53 | 49.68,15.5 v49.7,15.48 | v49.7,15.48 49.93,15.57 50.12,15.06 49.61,15.26 v49.7,15.48 | v75.18,15.53 75.09,15.3 74.58,15.53 75.09,15.75 v75.18,15.53
A14  (via drill 0.4)
  Top 0.254: IC2.3 76.63,28.49 arc-45 77,29.39 v77.87,30.26 | IC1.29 84.7,57.52 84.7,55.96 arc-45 84.32,55.06 81.26,52 arc45 80.88,51.1 80.88,41.01 arc45 81.26,40.11 81.53,39.84 arc-90 81.53,38.04 81.07,37.58 arc45 80.69,36.69 80.69,33.48 arc-45 80.32,32.59 78,30.26 v77.87,30.26 | v77.87,30.26 77.96,30.03 77.44,29.83 77.64,30.34 v77.87,30.26 | v77.87,30.26 77.82,30.5 78.35,30.61 78.08,30.14 v77.87,30.26
  Bottom 0.254: IC4.38 46.86,32.9 arc-45 47.76,33.27 59.72,33.27 arc-45 60.62,32.9 62.13,31.39 arc45 63.03,31.02 68.71,31.02 arc-45 69.6,30.65 arc45 70.47,30.29 77.84,30.29 v77.87,30.26 | v77.87,30.26 77.76,30.04 77.27,30.29 77.78,30.48 v77.87,30.26
A15  (via drill 0.4)
  Top 0.254: IC4.37 46.91,35.49 arc-45 47.53,35.75 arc45 48.43,36.12 48.95,36.65 arc-45 49.85,37.02 73.52,37.02 | 73.52,37.02 73.72,36.82 arc-45 74.09,35.92 IC2.31 | v75.9,40.58 75.9,39.93 arc-45 75.53,39.03 73.52,37.02 | v75.9,40.58 76.12,40.48 75.9,39.98 75.68,40.48 v75.9,40.58
  Bottom 0.254: IC1.3 82.19,43.21 81.61,43.79 arc45 80.71,44.16 77.19,44.16 arc45 76.29,43.79 76.27,43.77 arc45 75.9,42.88 v75.9,40.58 | v75.9,40.58 75.68,40.67 75.9,41.18 76.12,40.67 v75.9,40.58
A16
  Top 0.254: IC2.2 74.09,28.56 arc-45 74.46,29.45 77.59,32.59 arc45 77.96,33.48 77.96,35.16 arc-45 78.34,36.06 79.24,36.97 arc45 79.62,37.86 79.62,42.27 IC1.2
  Bottom 0.254: IC4.41 43.36,31.62 43.74,31.24 arc45 44.05,30.48 44.45,30.09 arc-45 44.82,29.19 44.82,26.92 arc-90 43.55,25.65 43.36,25.65 arc90 42.09,24.38 42.09,24.32 arc90 43.36,23.05 43.37,23.05 arc-90 44.64,21.78 44.64,19.49 arc90 45.53,18.22 67.21,18.22 arc45 68.11,18.6 70.03,20.52 arc-45 70.93,20.89 72.48,20.89 arc-45 73.38,20.52 74.09,19.81 IC2.2
A17  (via drill 0.4)
  Top 0.254: IC2.30 76.63,35.5 78.61,37.47 arc45 78.98,38.37 78.98,40.02 arc45 78.63,40.86 78.63,43.54 arc-45 79,44.44 79.31,44.74 arc45 79.68,45.64 79.68,52.18 arc-45 80.05,53.08 81.78,54.81 arc45 82.15,55.71 82.15,57.52 IC1.30 | IC4.36 49.59,33.09 arc-45 50.49,33.47 51.15,33.47 arc45 52.05,33.84 arc45 52.25,34.32 52.25,34.59 arc-45 52.62,35.49 arc-45 53.45,35.83 67.89,35.83 arc-45 68.79,35.46 v69.52,34.73 | v69.52,34.73 69.29,34.65 69.09,35.16 69.61,34.96 v69.52,34.73
  Bottom 0.254: v69.52,34.73 70.67,35.89 arc-45 71.57,36.26 74.9,36.26 arc-45 75.8,35.89 76.63,35.05 IC2.30 | v69.52,34.73 69.43,34.96 69.94,35.16 69.75,34.65 v69.52,34.73
A18
  Top 0.254: IC1.1 77.14,42.27 77.14,39.9 arc-45 76.77,39 75.73,37.96 arc45 75.36,37.07 75.36,32.59 arc-45 74.99,31.7 74.22,30.92 | IC4.39 44.19,33.65 arc45 45.09,33.27 48.35,33.27 arc45 49.25,33.65 49.4,33.79 arc45 49.77,34.69 49.77,34.84 arc-45 50.14,35.74 50.48,36.08 arc-45 51.38,36.45 71.55,36.45 arc-90 72.82,35.18 72.82,32.85 arc45 73.19,31.95 74.22,30.92 | 74.22,30.92 71.92,28.63 arc45 71.55,27.73 IC2.1
BLK1
  Top 0.254: U$2.P$13 72.73,10.36 arc45 72.36,11.26 69.95,13.66 arc45 69.06,14.03 57.85,14.03 arc-45 56.95,14.4 56.36,14.99 arc45 55.47,15.37 53.77,15.37 arc-90 52.5,16.64 52.5,17.7 arc-45 52.87,18.6 IC4.16
BLK2
  Top 0.254: IC4.14 51.62,18.6 arc-45 51.99,17.7 51.99,15.83 arc45 52.36,14.93 52.45,14.85 arc45 53.34,14.48 54.64,14.48 arc-45 55.54,14.11 55.88,13.77 arc45 56.77,13.4 65.82,13.4 arc-45 66.72,13.03 68.38,11.36 arc-45 68.76,10.46 68.76,5.61 U$2.P$12
BLK3
  Top 0.254: U$2.P$11 64.81,10.53 arc45 64.44,11.43 63.41,12.46 arc45 62.52,12.83 55.63,12.83 arc-45 54.73,13.2 54.59,13.34 arc45 53.69,13.72 52.52,13.72 arc-45 51.62,14.09 51.35,14.36 arc-45 50.98,15.26 IC4.13
BLK5
  Top 0.254: R10.2 50.04,39.12 arc45 49.14,38.74 47.6,37.2 arc-45 46.7,36.83 43.76,36.83 arc45 42.86,36.46 36.23,29.84 arc-45 35.34,29.46 26.8,29.46 arc45 25.9,29.09 24.74,27.93 arc45 24.37,27.03 24.37,25.36 arc45 24.74,24.46 25.33,23.87 arc45 26.23,23.5 DEVICE.6 29.3,23.5 arc-45 30.2,23.12 30.73,22.6 arc45 31.63,22.23 37.81,22.23 arc45 38.71,22.6 38.79,22.68 arc-45 39.69,23.05 44.1,23.05 arc-45 45,22.68 IC4.12
C_BLK5  (via drill 0.4)
  Top 0.254: U$2.P$10 60.85,10.37 arc45 60.48,11.27 60.11,11.63 arc45 59.21,12 v57.39,12 | DEVICE.3 36.48,23.49 arc45 37.38,23.87 v39.07,25.56 | v57.39,12 57.49,12.22 57.99,12 57.49,11.78 v57.39,12 | v39.07,25.56 39.16,25.33 38.65,25.13 38.84,25.65 v39.07,25.56
  Bottom 0.254: v39.07,25.56 39.07,24.32 arc90 40.34,23.05 40.91,23.05 arc-90 42.18,21.78 42.18,15.96 arc45 42.55,15.06 45.24,12.37 arc45 46.14,12 v57.39,12 | v57.39,12 57.29,11.78 56.79,12 57.29,12.22 v57.39,12 | v39.07,25.56 39.29,25.46 39.07,24.96 38.85,25.46 v39.07,25.56
C_R/W  (via drill 0.4)
  Top 0.254: v103.43,16.38 103.43,20.18 arc-45 103.8,21.07 103.94,21.22 arc45 104.32,22.12 104.32,26.08 arc-45 104.69,26.98 105.47,27.76 arc45 105.84,28.66 IC3.1 | U$2.P$5 41.05,13.19 v41.07,13.21 | v103.43,16.38 103.2,16.48 103.43,16.98 103.65,16.48 v103.43,16.38 | v41.07,13.21 41.29,13.1 41.05,12.61 40.84,13.12 v41.07,13.21
  Bottom 0.254: v41.07,13.21 42.29,13.21 arc-45 43.19,12.84 44.48,11.55 arc45 45.37,11.18 57.34,11.18 arc45 58.24,11.55 59.81,13.12 arc-45 60.71,13.49 76.77,13.49 arc45 77.67,13.87 arc-45 77.84,13.94 100.46,13.94 arc45 101.35,14.31 v103.43,16.38 | v41.07,13.21 40.71,13.21 arc-45 39.81,13.58 38.9,14.49 arc-45 38.53,15.38 38.53,17.44 arc-45 38.9,18.34 39.43,18.87 arc-45 40.33,19.24 IC4.6 | v103.43,16.38 103.52,16.16 103,15.96 103.2,16.47 v103.43,16.38 | v41.07,13.21 41.17,13.43 41.67,13.21 41.17,12.99 v41.07,13.21 | v41.07,13.21 40.96,12.99 40.47,13.23 40.98,13.43 v41.07,13.21
CD0
  Top 0.254: U$2.P$21 104.41,13.42 arc45 104.04,14.31 101.13,17.22 arc-45 100.76,18.12 IC3.18
CD1
  Top 0.254: U$2.P$20 100.45,13.09 arc45 100.08,13.99 98.59,15.47 arc-45 98.22,16.37 IC3.17
CD2
  Top 0.254: U$2.P$19 96.49,9.8 96.44,9.84 96.44,12.21 arc45 96.07,13.1 96.05,13.12 arc-45 95.68,14.02 IC3.16
CD3
  Top 0.254: IC3.15 93.14,12.3 arc-45 92.77,11.41 arc45 92.47,10.7 92.47,5.65 U$2.P$18
CD4
  Top 0.254: IC3.14 90.6,15.2 arc-45 90.23,14.3 88.94,13.01 arc45 88.57,12.11 88.57,5.6 U$2.P$17
CD5
  Top 0.254: 84.63,5.62 U$2.P$16 84.76,5.75 84.76,7.21 84.63,7.33 84.63,10.89 86.1,12.36 arc45 86.47,13.26 arc-45 86.8,14.04 87.69,14.93 arc45 88.06,15.83 88.06,20.32 87.93,20.45 87.93,22.86 IC3.13
CD6
  Top 0.254: IC3.12 85.52,15.93 arc-45 85.15,15.03 85.08,14.96 arc45 84.76,14.18 arc-45 84.39,13.28 82.75,11.64 arc-45 81.85,11.27 81.63,11.27 arc45 80.73,10.9 arc45 80.63,10.65 80.63,5.62 U$2.P$15
CD7
  Top 0.254: IC3.11 82.98,15 arc-45 82.61,14.11 80.14,11.64 arc-45 79.25,11.27 77.7,11.27 arc45 76.8,10.9 arc45 76.73,10.72 76.73,5.64 U$2.P$14
COOL  (via drill 0.4)
  other vias: 13.13,62.23 14.4,62.23 15.67,62.23 13.13,63.5 14.4,63.5 15.67,63.5
  pour Bottom (no thermals): 19.99,66.55 19.92,66.61 15.67,66.61 12.49,63.44 12.49,61.66 19.35,61.66 20.05,62.36 20.05,66.36 20.05,66.48 arc90
  pour Top (no thermals): 12.47,61.23 16.72,61.23 16.75,64.14 12.49,64.14
D0  (via drill 0.4)
  Top 0.254: IC2.13 102.03,25.38 arc-45 102.4,26.28 102.99,26.87 arc45 103.36,27.77 103.36,30.54 IC3.2 103.36,30.67 103.36,31.43 104.14,32.2 arc-45 104.57,32.38 arc90 105.84,33.66 105.84,35.54 arc-45 106.21,36.44 107.21,37.44 arc45 107.58,38.34 IC1.13 | v68.56,30.23 68.58,30.22 arc-45 68.95,29.32 68.95,17.73 arc-45 68.58,16.84 v68.5,16.76 | v68.56,30.23 68.81,30.26 68.88,29.72 68.43,30.02 v68.56,30.23 | v68.5,16.76 68.38,16.97 68.85,17.25 68.74,16.71 v68.5,16.76
  Bottom 0.254: IC2.13 102.03,20.1 arc90 100.76,21.37 97.51,21.37 arc45 96.61,21 96.05,20.44 arc45 95.68,19.54 95.68,18.22 arc-90 94.41,16.95 68.69,16.95 v68.5,16.76 | IC4.28 59.72,31.94 arc-45 60.62,31.57 61.4,30.79 arc45 62.3,30.42 arc-3 v68.56,30.23 | v68.5,16.76 68.47,16.73 | v68.56,30.23 68.45,30.01 67.97,30.26 68.48,30.45 v68.56,30.23 | v68.5,16.76 68.53,17.01 69.07,16.95 68.67,16.59 v68.5,16.76
D1  (via drill 0.4)
  Top 0.254: 107.11,26.41 105.2,24.5 arc45 104.83,23.6 104.83,19.56 IC2.14 | v106.73,26.8 107.11,26.41 | 107.11,26.41 111.06,30.36 arc45 111.43,31.25 111.43,35.99 arc45 111.06,36.88 110.5,37.45 arc-45 110.12,38.34 IC1.14 | v106.73,26.8 106.97,26.78 106.93,26.23 106.55,26.63 v106.73,26.8 | v106.73,26.8 106.9,26.97 107.29,26.59 106.75,26.55 v106.73,26.8
  Bottom 0.254: IC1.14 110.12,41.2 arc-45 109.75,40.3 106.21,36.76 arc45 105.84,35.86 105.84,33.72 arc-90 104.57,32.45 102.56,32.45 arc45 101.66,32.08 100.76,31.18 IC3.3 | v106.73,26.8 105.74,27.79 arc45 104.84,28.16 99.52,28.16 arc45 99.04,27.96 arc-45 98.14,27.59 87.82,27.59 arc-45 86.93,27.96 86.4,28.49 arc45 85.5,28.86 82.46,28.86 arc-45 81.56,29.23 arc45 81.16,29.4 65.79,29.4 arc45 64.89,29.03 64.3,28.44 arc-45 63.4,28.07 61.79,28.07 arc-45 60.89,28.44 60.3,29.03 arc45 59.4,29.4 IC4.26 | v106.73,26.8 106.5,26.71 106.31,27.22 106.82,27.02 v106.73,26.8
D2
  Top 0.254: IC1.15 112.7,42 112.7,27.84 arc45 113.07,26.95 114.58,25.43 arc-45 114.95,24.54 114.95,23.95 arc-45 114.58,23.06 113.91,22.39 arc-45 113.02,22.02 109.86,22.02 arc45 108.96,21.64 107.14,19.82 IC2.15
  Bottom 0.254: IC1.15 112.66,41.13 arc-45 112.29,40.23 108.75,36.69 arc45 108.38,35.8 108.38,30.69 arc-45 108.01,29.79 107.36,29.14 arc-45 106.46,28.77 100.27,28.77 arc-45 99.37,29.14 98.22,30.29 IC3.4 | IC4.24 59.12,26.86 arc-45 60.02,26.49 60.38,26.12 arc45 61.28,25.75 71.34,25.75 arc45 72.24,26.12 72.7,26.58 arc-45 73.6,26.96 84.61,26.96 arc-45 85.51,26.58 85.78,26.31 arc45 86.68,25.94 93.54,25.94 arc-45 94.44,25.57 arc45 94.76,25.43 96.18,25.43 arc45 96.36,25.5 arc-45 97.25,25.88 99.38,25.88 arc45 100.28,26.25 arc-45 100.76,26.45 101.85,26.45 arc-45 102.75,26.08 103.94,24.88 arc-45 104.32,23.98 104.32,22.15 arc45 104.69,21.25 105.28,20.66 arc45 105.63,20.51 arc-45 106.53,20.14 107.11,19.56 IC2.15
D3  (via drill 0.4)
  Top 0.254: v95.2,26.71 95.31,26.82 arc45 95.68,27.72 IC3.5 | IC4.21 56.56,21.78 57.46,22.68 arc-45 58.36,23.05 60.1,23.05 arc45 61,23.42 v65.14,27.56 | v95.2,26.71 95.08,26.93 95.56,27.19 95.44,26.66 v95.2,26.71 | v65.14,27.56 65.22,27.33 64.71,27.14 64.91,27.65 v65.14,27.56
  Bottom 0.254: IC1.17 115.17,57.5 115.17,46.95 arc-45 114.8,46.05 114.34,45.58 arc45 113.97,44.69 113.97,41.29 arc-45 113.6,40.4 110.02,36.82 arc45 109.65,35.92 IC2.17 109.65,28.91 arc-45 109.28,28.01 107.33,26.06 arc-45 106.49,25.72 arc-45 105.59,26.09 104.47,27.22 arc45 103.57,27.59 99.9,27.59 arc45 99.42,27.39 arc-45 98.52,27.02 95.2,27.02 | v65.14,27.56 65.16,27.56 | 95.2,27.02 87.51,27.02 arc-45 86.61,27.39 86.15,27.85 arc45 85.25,28.22 81.23,28.22 arc-45 80.38,28.57 70.42,28.57 arc45 69.53,28.2 68.81,27.49 arc-45 67.91,27.11 66.11,27.11 arc-45 65.21,27.49 v65.14,27.56 | v95.2,26.71 95.2,27.02 | v95.2,26.71 95,26.57 94.68,27.02 95.23,26.96 v95.2,26.71 | v95.2,26.71 95.17,26.96 95.72,27.02 95.4,26.57 v95.2,26.71 | v65.14,27.56 65.35,27.68 65.62,27.21 65.09,27.32 v65.14,27.56
D4  (via drill 0.4)
  Top 0.254: IC3.6 93.14,27.64 arc-45 92.77,26.74 v91.2,25.18 | v91.2,25.18 91.12,25.4 91.63,25.6 91.43,25.09 v91.2,25.18 | 110.82,45.26 111.52,45.02 v111.49,45.28 111.49,45.5 110.82,45.26 | 105.65,46.58 105.3,47.28 v105.2,47.05 105.06,46.89 105.65,46.58
  Top 0.305: v105.2,47.05 106.8,45.46 arc45 107.25,45.28 v111.49,45.28
  Bottom 0.254: IC2.18 107.11,35.8 arc-45 107.48,36.69 111.06,40.27 arc45 111.43,41.17 111.43,43.42 arc-45 111.8,44.31 112.13,44.64 | 112.13,44.64 112.26,44.78 113.39,45.91 arc45 113.58,46.36 113.58,54.63 113.58,55.74 arc45 113.39,56.19 112.74,56.84 arc-45 112.66,57.03 IC1.18 | IC3.6 93.14,31.4 arc-90 94.41,32.67 96.77,32.67 arc45 97.67,33.04 97.85,33.22 arc45 98.22,34.12 98.22,35.48 arc-45 98.59,36.38 100.83,38.62 arc45 101.2,39.52 101.2,43.8 arc-45 101.58,44.7 103.56,46.68 arc-45 104.46,47.05 v105.2,47.05 | IC4.25 56.12,26.8 56.48,26.8 arc-45 57.38,26.43 57.84,25.96 arc45 58.74,25.59 58.9,25.59 arc-45 59.79,25.22 arc45 60.43,24.96 65.39,24.96 66.28,24.07 75.34,24.07 arc45 76.24,24.44 76.96,25.16 arc-45 77.86,25.53 84,25.53 84.12,25.4 90.98,25.4 v91.2,25.18 | v111.49,45.28 112.13,44.64 | v91.2,25.18 91.03,25.01 90.65,25.4 91.19,25.42 v91.2,25.18 | v111.49,45.28 111.72,45.36 111.92,44.85 111.4,45.05 v111.49,45.28 | v105.2,47.05 105.11,46.83 104.61,47.05 105.11,47.28 v105.2,47.05
D5  (via drill 0.4)
  Top 0.254: IC3.7 90.6,27.7 arc-45 90.23,26.81 89.45,26.03 arc45 89.08,25.13 89.08,21.8 arc-45 v88.79,21.11 | v100.82,25.62 100.82,25.67 arc-45 101.2,26.57 101.91,27.28 arc45 102.28,28.18 102.28,31.19 arc-45 102.66,32.09 104.57,34 IC2.19 | v52.25,20.51 52.25,26.4 arc-45 52.62,27.3 54.35,29.03 arc-45 55.25,29.4 IC4.27 | v88.79,21.11 88.64,21.3 89.06,21.65 89.03,21.1 v88.79,21.11 | v52.25,20.51 52.02,20.61 52.25,21.11 52.47,20.61 v52.25,20.51 | v100.82,25.62 100.63,25.76 100.95,26.21 101.06,25.67 v100.82,25.62
  Bottom 0.254: IC2.19 104.57,35.73 arc-45 104.94,36.63 108.45,40.14 arc45 108.82,41.04 108.82,43.73 arc-45 109.2,44.63 110.52,45.95 arc45 110.71,46.4 110.71,54.2 arc20 IC1.19 | v88.79,21.11 88.98,21.11 arc-45 89.74,20.8 91.28,20.8 arc45 91.69,20.96 arc-45 92.59,21.34 93.14,21.34 arc90 94.41,22.61 94.41,23.48 arc-45 94.78,24.38 94.83,24.43 arc-45 95.73,24.8 96.14,24.8 arc45 97.04,25.17 arc-45 97.29,25.27 100.47,25.27 v100.82,25.62 | v52.25,20.51 59.34,20.51 arc-45 60.24,20.14 60.96,19.42 arc45 61.85,19.05 66.58,19.05 arc45 67.48,19.42 69.21,21.16 arc-45 70.11,21.53 74.79,21.53 75.17,21.14 88.76,21.14 v88.79,21.11 | v88.79,21.11 88.92,21.32 89.39,21.03 88.86,20.88 v88.79,21.11 | v88.79,21.11 88.68,20.9 88.19,21.14 88.7,21.34 v88.79,21.11 | v52.25,20.51 52.34,20.73 52.85,20.51 52.34,20.29 v52.25,20.51 | v100.82,25.62 100.87,25.38 100.34,25.27 100.61,25.75 v100.82,25.62
D6
  Bottom 0.254: IC4.29 59.59,34.48 arc-45 60.49,34.11 62.64,31.96 arc45 63.54,31.59 69.56,31.59 arc-45 70.41,31.24 79.95,31.24 arc45 80.84,31.61 81.08,31.85 arc-45 81.98,32.23 86.68,32.23 arc-45 87.58,31.85 87.69,31.74 arc-45 88.06,30.84 IC3.8 88.06,30.16 arc90 89.33,28.89 95.68,28.89 arc90 96.95,30.16 96.95,30.97 arc-45 97.32,31.87 97.58,32.13 arc-45 98.48,32.5 100.09,32.5 arc45 100.99,32.87 101.87,33.75 101.87,34.26 IC2.20 102.03,35.29 arc-45 102.4,36.19 105.91,39.7 arc45 106.28,40.59 106.28,43.35 arc-45 106.66,44.25 109.15,46.74 arc45 109.52,47.64 109.52,51.67 arc45 109.15,52.57 107.95,53.77 arc-45 107.58,54.66 IC1.20
D7  (via drill 0.4)
  Top 0.254: IC4.32 54.48,32.9 arc-45 55.38,33.27 59.78,33.27 arc45 60.68,33.65 61.84,34.81 arc-45 62.74,35.18 65.37,35.18 arc-45 66.27,34.81 arc-45 66.34,34.63 66.34,33.27 66.34,26.37 arc45 66.72,25.47 v67.23,24.96 | IC2.21 99.24,34.16 99.24,29.93 arc-45 98.86,29.03 v98.22,28.38 | v84.7,26.15 85.15,26.6 arc45 85.52,27.5 IC3.9 | v67.23,24.96 67.01,24.87 66.81,25.38 67.32,25.18 v67.23,24.96 | v84.7,26.15 84.61,26.38 85.12,26.57 84.92,26.06 v84.7,26.15 | v98.22,28.38 98.13,28.61 98.64,28.81 98.45,28.3 v98.22,28.38
  Bottom 0.254: v67.23,24.96 73.22,24.96 arc45 74.11,25.33 74.64,25.85 arc-45 75.54,26.23 84.62,26.23 v84.7,26.15 | v98.22,28.38 98.06,28.23 88.11,28.23 arc-45 87.21,28.6 85.58,30.23 IC3.9 | IC2.21 99.49,35.31 103.37,39.19 arc45 103.74,40.09 103.74,43.03 arc-45 104.12,43.93 105.85,45.67 arc45 106.22,46.56 106.22,49.13 arc45 105.85,50.03 105.77,50.11 arc-45 105.39,51.01 105.39,55.8 arc45 105.02,56.7 105.01,56.71 105.01,57.5 IC1.21 | v67.23,24.96 67.33,25.18 67.83,24.96 67.33,24.73 v67.23,24.96 | v84.7,26.15 84.57,25.94 84.1,26.23 84.63,26.38 v84.7,26.15 | v98.22,28.38 98.18,28.14 97.64,28.23 98.07,28.57 v98.22,28.38
EE/CE  (via drill 0.4)
  Top 0.254: v93.65,25.02 93.91,25.28 arc-45 94.74,25.62 arc45 95.64,25.99 96.32,26.68 arc45 96.7,27.58 96.7,31.54 arc-45 97.07,32.44 97.59,32.97 arc45 97.97,33.86 97.97,36.49 arc-45 98.34,37.39 arc45 98.67,38.18 98.67,39.78 v98.7,39.81 | v93.65,25.02 93.57,25.25 94.09,25.43 93.87,24.92 v93.65,25.02 | v98.7,39.81 98.91,39.7 98.67,39.22 98.47,39.73 v98.7,39.81
  Bottom 0.254: IC4.20 60.04,21.78 arc-45 60.94,21.41 62.03,20.31 arc45 62.93,19.94 66.04,19.94 arc45 66.94,20.31 68.38,21.76 arc-45 69.28,22.13 79.5,22.13 arc45 80.4,22.5 82.35,24.46 arc-45 83.25,24.83 87.98,24.83 arc-45 88.88,24.46 88.93,24.41 arc-45 89.3,23.51 89.3,22.69 arc45 89.67,21.79 89.72,21.74 arc45 90.62,21.37 90.71,21.37 arc45 91.61,21.74 arc45 91.93,22.53 91.93,23.64 arc-45 92.31,24.53 92.42,24.65 arc-45 93.32,25.02 v93.65,25.02 | v98.7,39.81 98.67,39.85 98.67,46.02 arc-45 99.04,46.92 102.13,50.01 arc45 102.5,50.91 IC1.22 | v93.65,25.02 93.56,24.79 93.05,24.99 93.54,25.24 v93.65,25.02 | v98.7,39.81 98.47,39.9 98.67,40.41 98.91,39.92 v98.7,39.81
EE/OE  (via drill 0.4)
  Top 0.254: IC4.19 56.06,19.54 arc45 55.68,20.44 55.22,20.9 arc-45 54.85,21.8 54.85,21.84 arc-90 56.12,23.11 56.18,23.11 arc90 57.39,24.32 arc-90 58.66,25.59 60.93,25.59 arc45 61.83,25.96 64.89,29.03 arc45 65.26,29.93 v65.26,34.42 | v91.78,45.4 91.78,53.82 arc-90 93.05,55.09 94.87,55.09 arc45 95.77,55.46 97.14,56.83 97.14,57.21 97.33,57.4 IC1.24 | v91.78,45.4 91.55,45.5 91.78,46 92,45.5 v91.78,45.4 | v65.26,34.42 65.49,34.32 65.26,33.82 65.04,34.32 v65.26,34.42
  Bottom 0.254: v91.78,45.4 88.05,45.4 arc45 87.15,45.03 86.56,44.44 arc-45 85.66,44.07 83.06,44.07 arc-45 82.16,44.44 81.89,44.71 arc45 80.99,45.09 76.46,45.09 arc45 75.56,44.71 74.34,43.49 arc45 73.96,42.59 73.96,39.33 arc-45 73.59,38.43 73.06,37.9 arc-45 72.17,37.53 71.06,37.53 arc45 70.16,37.16 arc11 67.29,34.79 arc-45 66.39,34.42 v65.26,34.42 | v91.78,45.4 91.68,45.18 91.17,45.4 91.68,45.62 v91.78,45.4 | v65.26,34.42 65.36,34.64 65.86,34.42 65.36,34.2 v65.26,34.42
G
  Bottom 0.254: IC4.7 44,17.34 arc-45 44.9,17.72 57.26,17.72 57.42,17.56 91.87,17.56 arc90 93.14,18.83 93.14,19.54 arc-45 93.51,20.44 93.59,20.52 arc-45 94.49,20.89 95.19,20.89 arc45 96.08,21.26 96.61,21.79 arc45 96.98,22.69 96.98,23.4 arc-90 98.25,24.67 101.82,24.67 arc-45 102.72,24.3 103.3,23.72 IC3.19
GND  (via drill 0.6, 0.7, 0.8, 1.4)
  Top 0.254: 75.75,75.58 75.75,76.1 | PAD1.1 45.04,75.58 45.04,76.1 | PAD2.1 75.75,75.58 | 75.75,75.58 76.92,75.58 | 6GD.1 66.79,47.38
  Top 0.305: JP3.5 100.14,67.49 100.14,67.68 | JP4.1 2.99,18.41 arc-45 2.09,18.79 1.44,19.44 arc-45 1.06,20.34 1.06,25.13 arc-45 1.44,26.03 2.37,26.96 arc-45 JP5.1
  Top 0.406: C6.2 30.91,46.04 | 34.66,41.78 34.66,44.77 arc90 33.39,46.04 30.91,46.04 | 30.91,46.04 C7.2 | 46.98,76.45 46.98,76.14 | 46.98,76.14 46.98,60.2 | 45.04,76.1 46.94,76.1 46.98,76.14
  Top 0.6: JP2.2 98.73,62.29 98.73,55.5 97.83,54.6 arc-45 96.93,54.23 93.73,54.23 arc45 92.83,53.86 arc45 92.63,53.38 92.63,49.91 92.82,49.72 92.82,45.61 arc45 93.19,44.71 93.28,44.63 arc-45 93.65,43.73 93.65,38.12 arc-45 93.28,37.22 92.24,36.19 arc45 91.87,35.29 IC2.24 | IC4.10 45,20.14 arc45 44.1,20.51 37.17,20.51 arc-45 37,20.58 arc45 36.1,20.95 DEVICE.2 | DRIVE_RST.2 RESET.1
  Top 0.61: IC7.3 IC7.4 100.09,54.66 arc-45 99.19,55.03 98.73,55.5
  Top 0.813: v80.82,24.45 arc45 81.14,25.21 81.14,28.05 arc-45 81.51,28.95 82.98,30.42 IC3.10 | 3GD.1 59.22,49.59 | 66.79,47.38 66.79,49.59 59.22,49.59 | 59.22,49.59 55.38,49.59 arc-45 54.48,49.97 47.41,57.03 arc45 46.51,57.4 31.44,57.4 arc-45 30.54,57.78 v30.15,58.17 | 117.62,56.61 117.62,57.09 128.24,57.09 arc45 129.14,57.46 DRIVE_RST.2
  Top 1.016: 9.57,59.75 12.92,59.75 arc-45 13.82,59.38 14.22,58.98 arc-45 14.59,58.08 IC6.2 14.59,53.34 arc-45 14.3,52.64 C10.2 | 75.68,75.6 75.75,76.1 | C8.- 7.91,67.82 arc-45 8.8,67.45 9.2,67.05 arc-45 9.57,66.15 9.57,59.75 | 9.57,59.75 v9.57,57.02 | C3.2 81.22,60.13 arc-45 80.32,60.51 76.11,64.72 arc-45 75.74,65.61 PAD2.1
  Top 1.27: v108.38,13.46 109.28,14.36 arc45 109.65,15.26 IC2.16 C5.2 120.31,26.42 CR2032.P$3 123.59,33.9 IC1.16 115.2,47.26 arc-45 115.58,48.15 116.07,48.65 arc45 116.45,49.55 116.45,54.91 arc-45 116.82,55.81 117.62,56.61 117.62,64.66 arc45 117.25,65.56 113.32,69.48 arc45 112.43,69.85 C12.- 102.31,69.85 102.14,69.68 | JP2.2 98.22,65.24 arc-45 98.59,66.14 100.14,67.68 102.14,69.68 | 102.14,69.68 98.63,73.19 arc45 97.73,73.57 95.35,73.57 arc-45 94.45,73.94 93.19,75.21 arc45 92.29,75.58 IEC2.PE IEC2.PE@ | 85.11,75.53 IEC2.PE@ | 76.92,75.58 IEC2.PE@ | 45.04,76.1 75.75,76.1 | IEC1.PE 45.04,75.58 | C1.2 34.66,41.78 33,40.12 arc-45 32.1,39.75 25.85,39.75 arc-45 24.95,40.12 22.53,42.55 IC5.11
  Top 2.54: U$2.P$44 108.38,5.61 v108.38,13.46 | v25.2,12.32 25.2,5.61 U$2.P$1
  Bottom 0.254: U$2.P$44 108.38,5.61 | 25.2,5.61 U$2.P$1
  Bottom 0.6: IC4.10 49.33,22.68 arc-45 50.23,23.05 56.8,23.05 arc45 57.7,23.42 IC4.22
  Bottom 0.61: JP4.1 3.2,15.35 arc45 3.57,14.45 4.69,13.33 arc45 5.59,12.95 14.65,12.95 | IC4.30 54.97,30.85 arc45 54.6,29.95 54.6,26.86 arc90 55.87,25.59 56.42,25.59 arc-45 57.32,25.22 58.22,24.32 IC4.22
  Bottom 0.813: IC4.22 58.6,24.13 58.85,24.13 59.17,23.81 63.53,23.81 arc-45 64.43,23.44 64.45,23.42 arc45 65.34,23.05 67.53,23.05 C2.2 76.91,23.07 arc45 77.81,23.44 78.44,24.08 arc-45 79.34,24.45 v80.82,24.45 80.76,24.38 | 20.24,59.05 23.93,59.05 | C9.2 26.21,59.05
  Bottom 1.016: C8.- 8.09,67.82 arc45 8.99,68.19 10.28,69.48 arc-45 11.18,69.85 21.83,69.85 arc90 23.1,71.12 23.1,72.25 arc-45 23.47,73.14 25.52,75.19 arc-45 26.42,75.56 30.64,75.56 IEC1.PE@ | IC5.31 10.7,40.01 arc45 11.6,40.38 18.08,46.86 | IC5.11 21.59,42.55 arc-45 20.7,42.92 20.36,43.25 arc-45 19.99,44.15 19.99,44.43 arc45 19.62,45.33 18.08,46.86 | C10.2 17.73,47.01 arc45 18.08,46.86
  Bottom 1.27: R2.1 R3.1 | 23.93,59.05 26.21,59.05 28.73,59.05 arc-45 29.63,58.68 v30.15,58.17 | R2.1 14.59,13.02 14.65,12.95 24.56,12.95 v25.2,12.32 30.92,18.04 arc-45 31.82,18.41 DEVICE.1 DEVICE.2 35.1,20.95 36.19,22.04 arc45 36.56,22.94 36.56,26.78 arc-45 36.93,27.68 38.66,29.4 | R2.1 R1.1 | 38.66,29.4 IC4.42 | 38.66,29.4 38.66,40.64 C1.2 | v9.57,57.02 11.23,58.68 arc-45 12.13,59.05 20.24,59.05 | IEC1.PE IEC1.PE@ | C4.2 arc45 27.29,38.22 23.34,42.17 arc45 22.45,42.55 IC5.11
  Bottom 2.54: v108.38,13.46 108.37,13.45 U$2.P$44 | 25.2,5.61 v25.2,12.32
  pour Top (isolate 0.406, no thermals, hatched): 46.7,76.8 46.7,60.2 55.87,50.8 74,50.8 74,76.8
  pour Top: 46.85,60.13 47.17,60.13 47.17,59.82
  pour Top: 47.67,59.31 47.99,59.31 47.99,58.99
  pour Top: 48.44,58.48 48.75,58.48 48.75,58.17
  pour Top: 49.26,57.66 49.58,57.66 49.58,57.34
  pour Top: 50.09,56.83 50.4,56.83 50.4,56.52
  pour Top: 50.85,56.01 51.17,56.01 51.17,55.69
  pour Top: 51.67,55.18 51.99,55.18 51.99,54.86
  pour Top: 52.5,54.36 52.82,54.36 52.82,54.04
  pour Top: 53.33,53.53 53.64,53.53 53.64,53.21
  pour Top: 54.09,52.7 54.41,52.7 54.41,52.39
  pour Top: 54.91,51.88 55.23,51.88 55.23,51.56
  pour Top: 73.58,51.18 73.9,51.18 73.9,50.86
  pour Top: 71.11,51.18 71.42,51.18 71.42,50.86
I2C_N  (via drill 0.4)
  Top 0.305: IC7.5 96.35,45.16 arc45 95.45,44.79 v95.23,44.58 | v95.23,44.58 95.16,44.78 95.68,44.98 95.43,44.48 v95.23,44.58
  Bottom 0.254: R8.1 94.26,48.77 | JP3.4 105.96,61.4 arc-45 105.06,61.02 104.4,61.02 arc45 103.5,60.65 103.23,60.38 arc-45 102.33,60.01 97.86,60.01 arc45 96.96,59.64 96.5,59.17 arc45 96.12,58.27 96.12,51.26 arc-45 95.75,50.37 94.23,48.84 R8.1 | v95.23,44.58 95.56,44.9 arc45 95.93,45.8 95.93,46.59 arc45 95.56,47.49 94.25,48.8 | v95.23,44.58 95.14,44.8 95.65,45.01 95.46,44.49 v95.23,44.58 | R8.1 arc-90 93.23,47.8 92.54,47.8 arc27 90.58,47.48 arc-24 87.98,46.98 84.13,47.06 74.62,47.06 arc-45 73.92,47.35 67.08,54.19 arc45 66.37,54.48 25.78,54.48 arc-45 25.08,54.77 23.65,56.19 arc45 22.95,56.49 15.58,56.49 arc45 14.87,56.19 9.13,50.46 arc-45 8.43,50.16 IC5.27
  Bottom 0.305: 94.25,48.8 R8.1
I2C_P  (via drill 0.4)
  Top 0.305: v101.71,47.56 101.71,46.86 | 101.71,46.86 IC7.6 | R9.1 94.81,46.49 arc-45 95.7,46.86 101.71,46.86 | v101.71,47.56 101.92,47.48 101.71,46.96 101.51,47.48 v101.71,47.56
  Bottom 0.254: R9.1 arc90 93.2,46.95 92.54,46.95 arc28 90.91,46.69 arc-24 87.97,46.13 87.26,46.13 arc45 86.56,45.83 85.74,45.02 arc-45 85.04,44.73 83.58,44.73 arc-45 82.88,45.02 81.99,45.91 arc45 81.28,46.2 74.27,46.2 arc-45 73.56,46.5 66.73,53.33 arc45 66.02,53.62 25.43,53.62 arc-4 23.95,53.81 arc9 22.21,53.95 21.07,53.95 arc-45 20.37,54.24 19.27,55.34 arc45 18.56,55.63 15.93,55.63 arc45 15.22,55.34 7.8,47.92 arc-45 7.09,47.62 IC5.28
  Bottom 0.305: v101.71,47.56 103.47,49.32 arc45 103.84,50.22 103.84,58.61 arc-90 105.11,59.88 106.46,59.88 arc45 107.36,60.25 JP3.3 | v101.71,47.56 101.62,47.76 102.14,47.99 101.91,47.47 v101.71,47.56
IEC_ATN